# EAGLE schematic IR Sensor - 6 Channels (EAGLE 9.6.2)
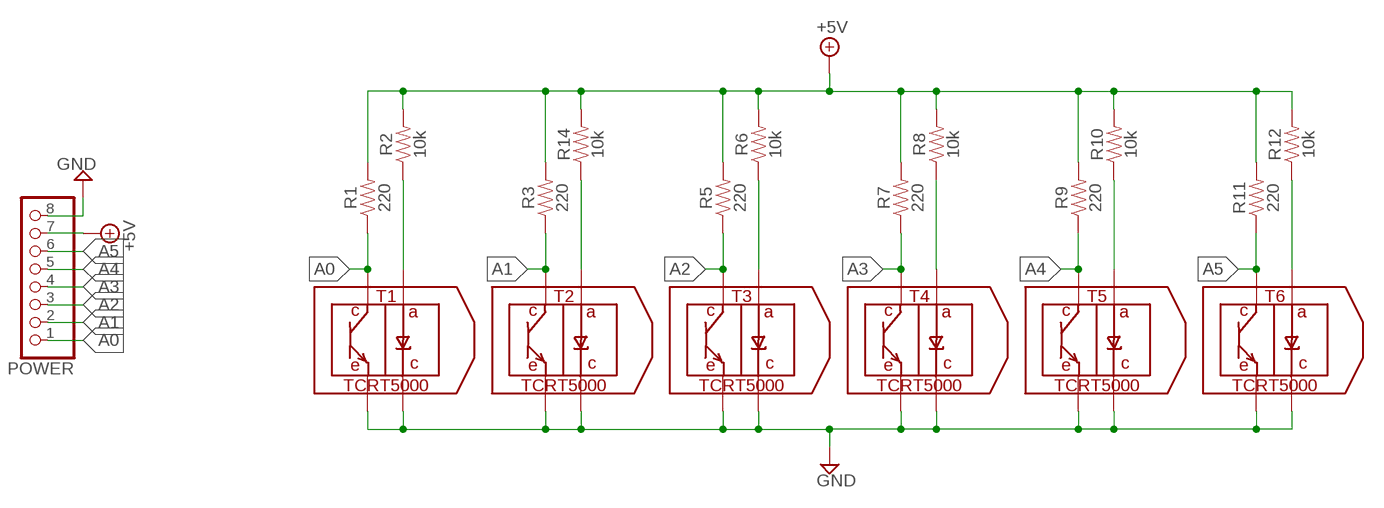
[diagram p0: schematic, sheet 1]

## Parts
POWER  PINHD-1X8/90  [1X08/90]
R1  220  RESISTOR1206  [1206]
R2  10k  RESISTOR1206  [1206]
R3  220  RESISTOR1206  [1206]
R5  220  RESISTOR1206  [1206]
R6  10k  RESISTOR1206  [1206]
R7  220  RESISTOR1206  [1206]
R8  10k  RESISTOR1206  [1206]
R9  220  RESISTOR1206  [1206]
R10  10k  RESISTOR1206  [1206]
R11  220  RESISTOR1206  [1206]
R12  10k  RESISTOR1206  [1206]
R14  10k  RESISTOR1206  [1206]
T1  TCRT5000  [5000]
T2  TCRT5000  [5000]
T3  TCRT5000  [5000]
T4  TCRT5000  [5000]
T5  TCRT5000  [5000]
T6  TCRT5000  [5000]

## Nets
+5V: POWER.7 R1.2 R2.2 R3.2 R5.2 R6.2 R7.2 R8.2 R9.2 R10.2 R11.2 R12.2 R14.2
A0: POWER.1 R1.1 T1.P$1
A1: POWER.2 R3.1 T2.P$1
A2: POWER.3 R5.1 T3.P$1
A3: POWER.4 R7.1 T4.P$1
A4: POWER.5 R9.1 T5.P$1
A5: POWER.6 R11.1 T6.P$1
GND: POWER.8 T1.P$2 T1.P$4 T2.P$2 T2.P$4 T3.P$2 T3.P$4 T4.P$2 T4.P$4 T5.P$2 T5.P$4 T6.P$2 T6.P$4
N$3: R2.1 T1.P$3
N$5: R14.1 T2.P$3
N$7: R6.1 T3.P$3
N$8: R12.1 T6.P$3
N$10: R10.1 T5.P$3
N$13: R8.1 T4.P$3

## Library data of the parts
POWER = pinhead:PINHD-1X8: PIN HEADER
R1-R3 R5-R12 R14 = SparkFun-Resistors:RESISTOR: Generic Resistor Package
T1-T6 = IR Sensors:TCRT5000: Reflective Optical Sensor with Transistor Output. Vishay Semiconductors